# Altium schematic sheet POWER.SchDoc
size A; SheetNumber: 1; SheetTotal: 5; SPICEModelCachePBXSBNCE: <root> / <DocumentId>PBXSBNCE</DocumentId> / <CacheFrame Number="0"> / <Model Name="gmk105bj104_v-f" Kind="CKT"> / <Text>* GMK105BJ104_V-F     SPICE MODEL  ( General Type ) / *-------------------------------------------------------------------------------------------------------- / * Model Generated by TAIYO YUDEN Corporation (http://www.ty-top.com) / * Version 1.0 / * TAIYO YUDEN Control No. 170508_061226 / * Copyright(c) 2012 TAIYO YUDEN CO.,LTD. All Rights Reserved. / *-------------------------------------------------------------------------------------------------------- / * / * Products Name : Multilayer Ceramic Capacitors / * / * Characteristics : / *     Capacitance : 0.1 uF , Rated Voltage : 35V , TCC : B / X5R / *     Case Size : 1.0 x 0.5 / 0.039 x 0.02 [mm/inch] , Thickness : 0.5 / 0.02 [mm/inch] / *     (Conditions: Temperature = 25 degC , DC Bias Current/Voltage = 0A / 0V) / * / * Frequency Range : 40Hz - 3GHz / * / * External Node Assignments : / * / *  1  o---| |---o  2 / * / *-------------------------------------------------------------------------------------------------------- / .SubCkt GMK105BJ104_V-F 1 2 / **************************** / C0 1 110 0.070351u / Cm 1 101 0.016111u / C1 101 102 0.069296u / Rc1 101 102 16.146k / C2 102 103 0.030776u / Rc2 102 103 344.14 / C3 103 110 0.021195u / Rc3 103 110 5.1627 / C2m 1 301 0.020847u / C21 301 302 0.28927u / Rc21 301 302 15.286k / C22 302 303 0.26628u / Rc22 302 303 12.239k / C23 303 304 0.21132u / Rc23 303 304 15.145k / C24 304 305 0.078855u / Rc24 304 305 2.6688k / C25 305 306 0.20986u / Rc25 305 306 330.59 / C26 306 307 0.078155u / Rc26 306 307 723.11 / C27 307 308 0.029921u / Rc27 307 308 64.708 / C28 308 309 0.019548u / Rc28 308 309 24.402 / C29 309 110 1666p / Rc29 309 110 0.83666 / Rp0 1 110 5G / L0 110 120 0.25789n / Lm 120 130 0.093457n / L1 120 121 1.1632p / RL1 121 130 0.63209 / L2 120 122 2.3124p / RL2 122 130 1.1301 / L3 120 123 6.01p / RL3 123 130 4.6768 / CR 120 124 0.022616u / LR 124 125 0.050216n / RR 125 130 0.12272 / CL 130 140 1.7584p / LL 130 140 0.19044n / RL 130 140 98.661 / Rs 140 2 25.54m / **************************** / .ends GMK105BJ104_V-F</Text> / </Model> / <Model Name="gmk316ab7106_l-tr" Kind="CKT"> / <Text>* GMK316AB7106_L-TR     SPICE MODEL  ( General Type ) / *-------------------------------------------------------------------------------------------------------- / * Model Generated by TAIYO YUDEN Corporation (http://www.ty-top.com) / * Version 1.0 / * TAIYO YUDEN Control No. 170508_150223 / * Copyright(c) 2015 TAIYO YUDEN CO.,LTD. All Rights Reserved. / *-------------------------------------------------------------------------------------------------------- / * / * Products Name : Multilayer Ceramic Capacitors / * / * Characteristics : / *     Capacitance : 10 uF , Rated Voltage : 35V , TCC : X7R / *     Case Size : 3.2 x 1.6 / 0.126 x 0.063 [mm/inch] , Thickness : 1.6 / 0.063 [mm/inch] / *     (Conditions: Temperature = 25 degC , DC Bias Current/Voltage = 0A / 0V) / * / * Frequency Range : 40Hz - 3GHz / * / * External Node Assignments : / * / *  1  o---| |---o  2 / * / *-------------------------------------------------------------------------------------------------------- / .SubCkt GMK316AB7106_L-TR 1 2 / **************************** / C0 1 110 8.3324u / Cm 1 101 1.7802u / C1 101 102 3.8737u / Rc1 101 102 1.0428k / C2 102 103 2.6786u / Rc2 102 103 137.64 / C3 103 110 3.2592u / Rc3 103 110 0.72408 / C2m 1 301 1.3977u / C21 301 302 15.657u / Rc21 301 302 626.86 / C22 302 303 14.784u / Rc22 302 303 557.81 / C23 303 304 12.901u / Rc23 303 304 562.75 / C24 304 305 4.4911u / Rc24 304 305 239.54 / C25 305 306 2.8869u / Rc25 305 306 59.913 / C26 306 307 2.0034u / Rc26 306 307 27.629 / C27 307 308 2.0039u / Rc27 307 308 11.805 / C28 308 309 0.76536u / Rc28 308 309 18.018 / C29 309 110 0.087712u / Rc29 309 110 0.70541 / Rp0 1 110 10Meg / L0 110 120 0.29453n / Lm 120 130 0.27934n / L1 120 121 0.13982n / RL1 121 130 0.1458 / L2 120 122 0.50993n / RL2 122 130 0.17601 / L3 120 123 1.9812n / RL3 123 130 0.20956 / CR 120 124 1.0165u / LR 124 125 0.77549n / RR 125 130 30.723m / CL 130 140 1.2238p / LL 130 140 0.29705n / RL 130 140 42.338 / Rs 140 2 3.9735m / **************************** / .ends GMK316AB7106_L-TR</Text> / </Model> / </CacheFrame> / </root>
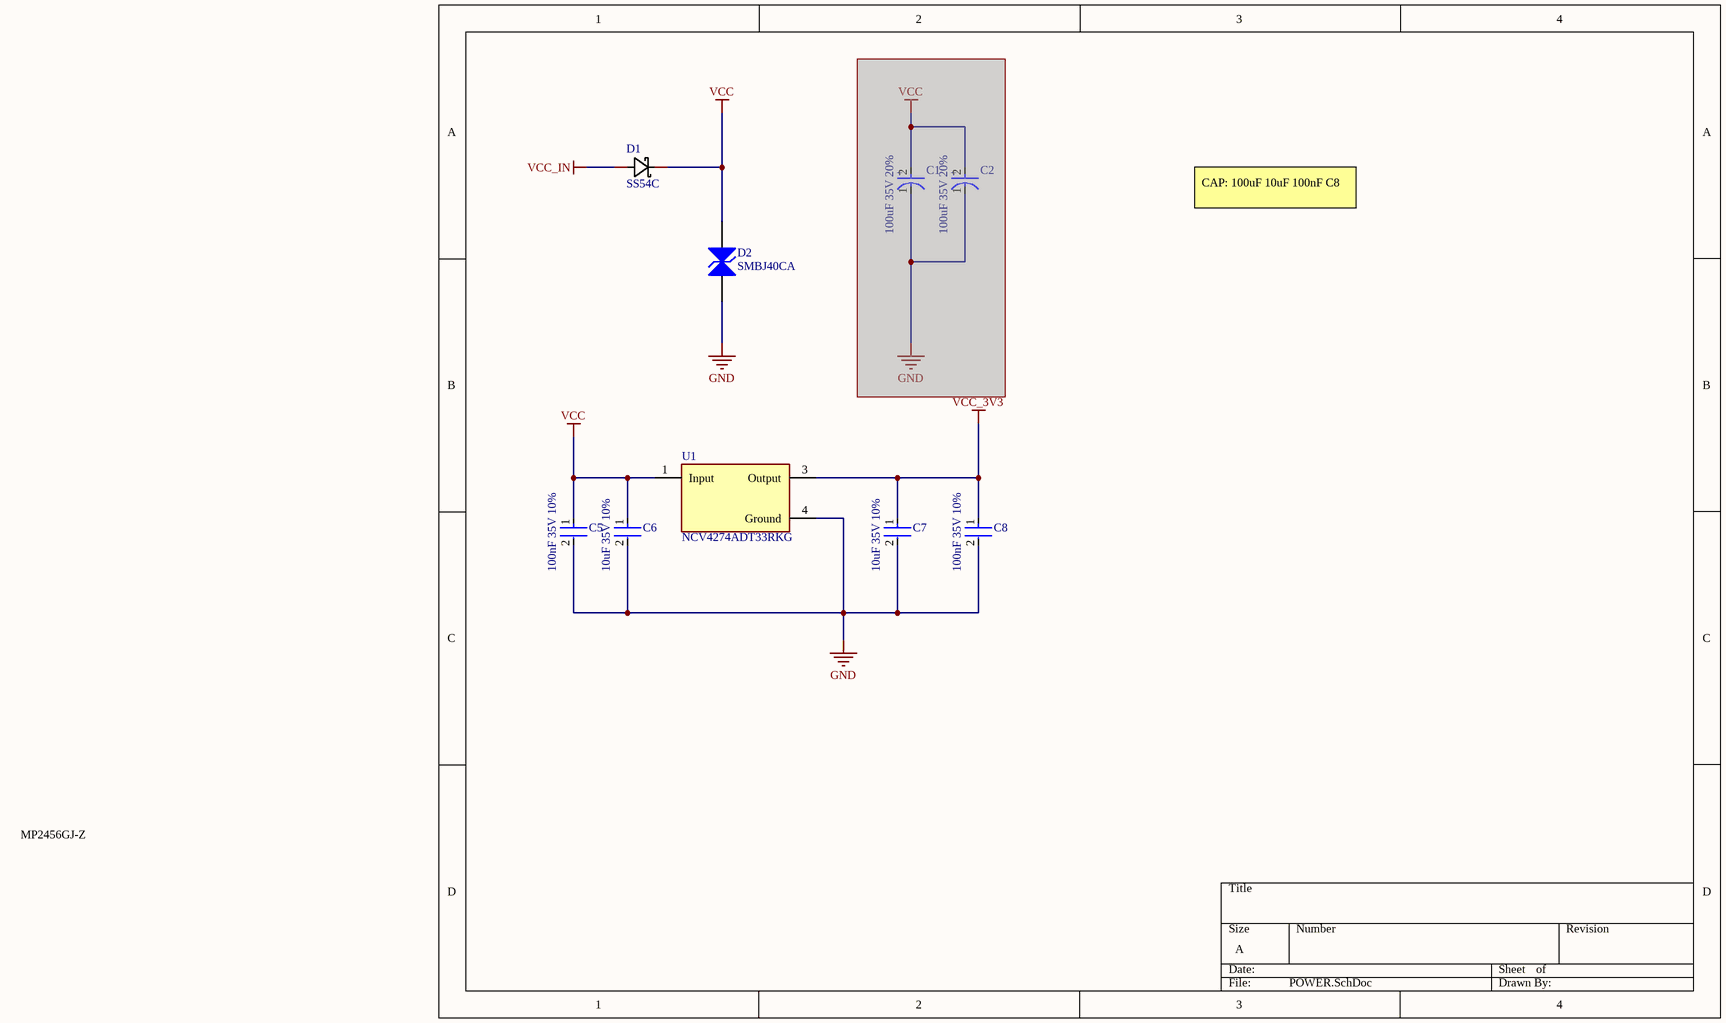
[diagram p0: POWER.SchDoc]

## Parts
C1  100uF 35V 20%  [FP-FTD-MFG]  (masked out: inside a compile mask, not in the netlist)
C2  100uF 35V 20%  [FP-FTD-MFG]  (masked out: inside a compile mask, not in the netlist)
C5  100nF 35V 10%  [FP-0402-L_1_0_0_05-W_0_5-IPC_A]
C6  10uF 35V 10%  [FP-1206-L_3_2_0_2-W_1_6_0-MFG]
C7  10uF 35V 10%  [FP-1206-L_3_2_0_2-W_1_6_0-MFG]
C8  100nF 35V 10%  [FP-0402-L_1_0_0_05-W_0_5-IPC_A]
D1  SS54C  [SMC_L6.9-W5.9-LS7.9-RD]
D2  SMBJ40CA  [FAIR-DO-214AA-A-2_V]
U1  NCV4274ADT33RKG  [FP-369C-MFG]

## Nets
GND: C5.2 C6.2 C7.2 C8.2 D2.2(A) U1.4(Ground)
VCC: C5.1 C6.1 D1.1(C) D2.1(A) U1.1(Input)
VCC_3V3: C7.1 C8.1 U1.3(Output)
VCC_IN: D1.2(A)

## Notes on the sheet
- CAP: 100uF 10uF 100nF C8
- MP2456GJ-Z
- (in symbol CMP-05427-000027-1) +

## Library data of the parts
C1 C2 = CMP-05427-000027-1: CAP ALUM 100UF 20% 35V SMD; Ripple Current: 300mA; Polarity: Polar; Life (Hours): 2000Hour; Lead Diameter: 0.65mm; ESR (Equivalent Series Resistance): 260mR; Leakage Current: 35uA; REACH SVHC: No SVHC; Series: FT; Min Operating Temperature: -55°C; Diameter: 6.3mm; Max Operating Temperature: 105°C; Number of Pins: 2; Package Quantity: 1000; Length: 5.8mm; Lead Pitch: 1.8mm; Voltage: 35V; Construction: Cylindrical; Capacitance: 100uF; Height: 5.8mm; Tolerance: 20%; RoHS Compliant: Yes; Packaging: Tape and Reel; Ripple Current (AC): 300mA; Height - Seated (Max): 0.24inch; Voltage Rating: 35V; Radiation Hardening: No; Contact Plating: Tin; Termination: SMD/SMT; Voltage Rating (DC): 35V; Case/Package: Radial; Mount: Surface Mount
C5 C8 = CMP-2000-06323-3: Dielectric: X5R; Voltage: 35V; Voltage Rating: 35V; Halogen Free: Halogen Free; Mount: Surface Mount; Max Operating Temperature: 85°C; Width: 0.02inch; Tolerance: 10%; Min Operating Temperature: -55°C; Length: 1mm; REACH SVHC: No SVHC; Voltage Rating (DC): 35V; Resistor Type: Ceramic; Radiation Hardening: No; Series: M; Termination: SMD/SMT; RoHS Compliant: Yes; Case/Package: 0402; Height: 0.5mm; Packaging: Tape and Reel; Construction: Flat; Capacitance: 100nF; Case Code (Metric): 1005; Case Code (Imperial): 0402; Depth: 0.5mm; Number of Pins: 2; Package Quantity: 1; Thickness: 0.022inch
C6 C7 = CMP-2000-06324-3: None; Dielectric: X7R; Thickness: 0.071inch; Mount: Surface Mount; Case Code (Imperial): 1206; Voltage Rating (DC): 35V; RoHS Compliant: Yes; Voltage Rating: 35V; Capacitance: 10uF; Case Code (Metric): 3216; Tolerance: 10%; Height: 1.6mm; Packaging: Tape and Reel; Resistor Type: Ceramic; REACH SVHC: No SVHC; Max Operating Temperature: 125°C; Termination: SMD/SMT; Package Quantity: 2000; Width: 1.6mm; Case/Package: 1206; Length: 0.126inch; Series: M; Min Operating Temperature: -55°C
D1 = SS54C_C880739: 二极管配置:-;直流反向耐压(Vr):40V;平均整流电流(Io):5A;正向压降(Vf):550mV@5A;反向电流(Ir):500A@40V;; Manufacturer: Slkor(萨科微); Add into BOM: yes; Reverse Voltage (Vr): 40V; Average Rectified Current (Io): 5A; Symbol: SS54C_C880739; Device: SS54C_C880739; LCSC Part Name: 40V 5A 550mV@5A; Supplier Part: C880739; Manufacturer Part: SS54C; Supplier Footprint: SMC(DO-214AB); JLCPCB Part Class: 扩展库; Datasheet: https://atta.szlcsc.com/upload/public/pdf/source/20201013/C880739_D47B31F19BD092A88A6CE51787FFA2A3.pdf; Supplier: LCSC; Convert to PCB: yes; Diode Configuration: -; Forward Voltage (Vf@If): 550mV@5A; Reverse Leakage Current (Ir): 500A@40V
D2 = CMP-2000-07097-1: Transient Voltage Suppressor, 600 W, 40 V, -55 to 150 degC, 2-Pin SMD, RoHS, Tape and Reel; Manufacturer: Fairchild Semiconductor; Breakdown Voltage-Max: 49.1V; Power Dissipation: 600W; Directional: Bi-Directional; Clamping Voltage-Max: 64.5V; Breakdown Voltage-Min: 44.4V; Datasheet URL: https://www.fairchildsemi.com/datasheets/SM/SMBJ40CA.pdf; Package Description: 2-Pin Surface Mount Device, Body 4.4 x 3.625 mm; Package Reference: DO-214AA; Manufacturer URL: https://www.fairchildsemi.com/; Mounting Technology: SurfaceMount; Datasheet Version: Rev. 1.1.1, 11/2014
U1 = CMP-07128-000011-1: IC REG LINEAR 3.3V 400MA DPAK; Manufacturer: ON SEMICONDUCTOR; Dropout Voltage: 1.27V; Automotive Grade: Grade 0; Number Of Outputs: 1; Max Supply Voltage: +45V; Accuracy Percentage: 2%; Standoff Height: 0mm; Max Junction Temp: +150°C; Min Supply Voltage: -42V; Output Type: Fixed; Nominal Supply Current: 145-30000uA; Digikey Description: IC REG LINEAR 3.3V 400MA DPAK; Manufacturer Part Number: NCV4274ADT33RKG; ComponentLink2Description: Datasheet; Lead Free: Yes; Output Current: 400mA; Temperature Range Low: -40°C; Temperature: -40°C to +150°C; Device Class L2: Power Management ICs; Category: IC; Device Class L1: Integrated Circuits (ICs); Octopart: https://octopart.com/ncv4274adt33rkg-on+semiconductor-10550992; Footprint Url: https://www.onsemi.com/pub/Collateral/369C.PDF; Automotive: Yes; Package: 369C; Mouser Description: IC REG LINEAR 3.3V 400MA DPAK-3; Device Class L3: Voltage Regulators - Linear; RoHS: TRUE; Height: 2.51mm; Output Voltage: 3.3V; Temperature Range High: +150°C; ComponentLink2URL: https://www.onsemi.com/pub/Collateral/NCV4274-D.PDF